# Altium schematic sheet 04-LogicAND.SchDoc
size A4; DocumentNumber: 4; SheetNumber: 4; SheetTotal: 26
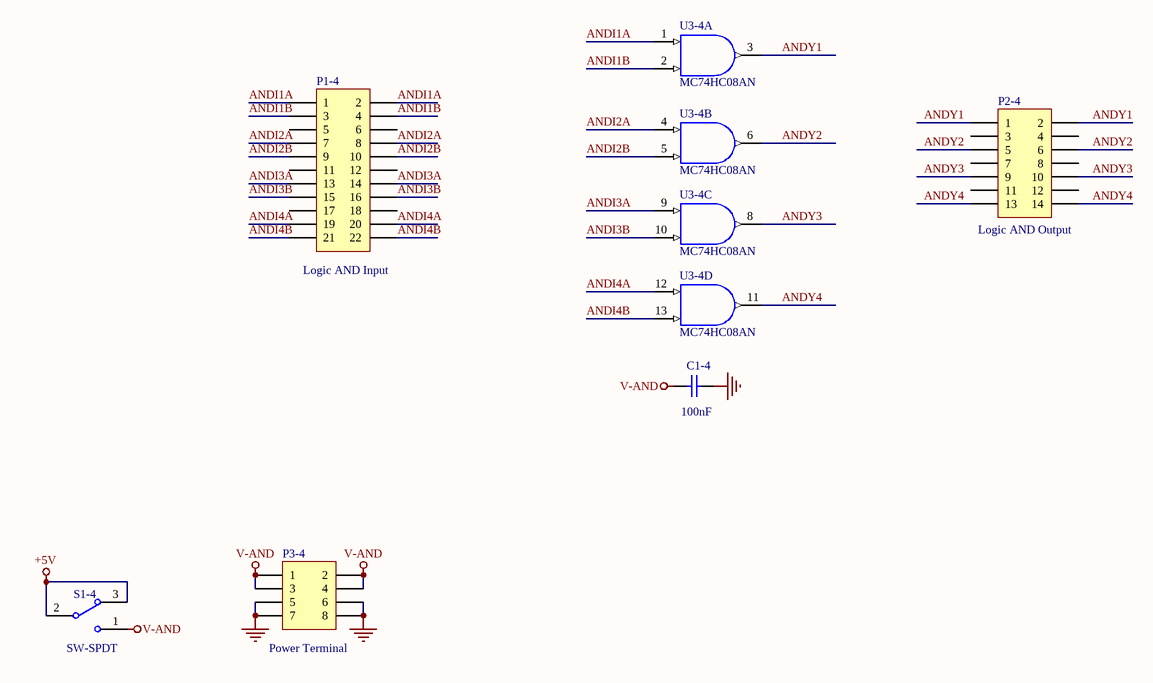
[diagram p0: 04-LogicAND.SchDoc]

## Parts
C1-4  value 100nF  [c-0805]  (hidden comment: 104)
P1-4  value Logic AND Input  [JP2.54-F-2x11A]  (hidden comment: Header 11X2)
P2-4  value Logic AND Output  [JP2.54-F-2x07A]  (hidden comment: H7X2)
P3-4  Publisher: Power Terminal  [JP2.54-F-2x04A]  (hidden comment: Header 4X2)
S1-4  SW-SPDT  [SW-SLIDE-2P-2W]
U3-4  MC74HC08AN  [SK-DIP14-300]  (parts A,B,C,D of 4)

## Nets
+5V: S1-4.2 S1-4.3
GND: C1-4.2 P3-4.5 P3-4.6 P3-4.7 P3-4.8 U3-4.7(GND)
V-AND: C1-4.1 P3-4.1 P3-4.2 P3-4.3 P3-4.4 S1-4.1
VDD: U3-4.14(V-AND)
ANDI1A: P1-4.1 P1-4.2 U3-4.1(A)
ANDI1B: P1-4.3 P1-4.4 U3-4.2(B)
ANDI2A: P1-4.7 P1-4.8 U3-4.4(A)
ANDI2B: P1-4.9 P1-4.10 U3-4.5(B)
ANDI3A: P1-4.13 P1-4.14 U3-4.9(A)
ANDI3B: P1-4.15 P1-4.16 U3-4.10(B)
ANDI4A: P1-4.19 P1-4.20 U3-4.12(A)
ANDI4B: P1-4.21 P1-4.22 U3-4.13(B)
ANDY1: P2-4.1 P2-4.2 U3-4.3(Y)
ANDY2: P2-4.5 P2-4.6 U3-4.6(Y)
ANDY3: P2-4.9 P2-4.10 U3-4.8(Y)
ANDY4: P2-4.13 P2-4.14 U3-4.11(Y)

Not connected (* = marked no-connect by the designer): P1-4 5 6 11 12 17 18; P2-4 3 4 7 8 11 12

## Library data of the parts
C1-4 = Cap: Capacitor; Published: 8-Jun-2000; LatestRevisionDate: 17-Jul-2002; LatestRevisionNote: Re-released for DXP Platform.; PackageReference: RAD-0.3; Publisher: Altium Limited; PackageDescription: Radial Cap, Thru-Hole; 2 Leads; 0.3 in Pin Spacing
P1-4 = Header 11X2: Header, 11-Pin, Dual row; LatestRevisionDate: 17-Jul-2002; LatestRevisionNote: Re-released for DXP Platform.
P2-4 = Header 7X2: Header, 7-Pin, Dual row; LatestRevisionDate: 17-Jul-2002; LatestRevisionNote: Re-released for DXP Platform.
P3-4 = Header 4X2: Header, 4-Pin, Dual row; LatestRevisionDate: 17-Jul-2002; LatestRevisionNote: Re-released for DXP Platform.
S1-4 = SW-SPDT: SPDT Subminiature Toggle Switch, Right Angle Mounting, Vertical Actuation; Published: 24-Mar-1999; LatestRevisionDate: 17-Dec-2003; LatestRevisionNote: Schematic revised, PCB Footprint replaced.; DatasheetVersion: 05-Dec-2000; PackageReference: TL36WW15050; Publisher: Altium Limited; PackageDescription: Switch; 4 Leads; ComponentLink1Description: Manufacturer Link; ComponentLink1URL: http://www.apem.com
U3-4 = MC74HC08AN: Quad 2-Input AND Gate; Published: 17-Jul-2002; LatestRevisionDate: 06-Jun-2005; LatestRevisionNote: Stylized 3D Model Added; DatasheetVersion: 1989; PackageVersion: 1997; PackageReference: 646-06; Publisher: Altium Limited; PackageDescription: DIP; 14 Leads; Row Spacing 7.62 mm; Pitch 2.54 mm; ComponentLink1Description: Manufacturer Link; ComponentLink1URL: http://www.onsemi.com/site/products/parametrics/0,4446,247,00.html; ComponentLink2Description: Ibis Model; ComponentLink2URL: http://www.onsemi.com/pub/Collateral/MC54HC08AJ.IBS